# Altium project MCU089A.PrjPcb (part 2 of 4)

## Sheet MCU089A_F280025C_Device.SchDoc
size 431 x 279 mm; Date: Not shown in title block; ApprovedBy: Not shown in title block; CheckedBy: Not shown in title block; Author: Not shown in title block; CompanyName: Not shown in title block; Engineer: Not shown in title block; Organization: Not shown in title block; Address1: Not shown in title block; Address2: Not shown in title block; Address3: Not shown in title block; Address4: Not shown in title block; DocumentNumber: 4; Revision: Use project parameter SCH_Rev; SheetNumber: 4; SheetTotal: 8; PageSetup: Record=PageOptions|CenterHorizontal=True|CenterVertical=True|PrintScale=1.00|XCorrection=1.00|YCorrection=1.00|PrintKind=0|BorderSize=5000000|LeftOffset=0|BottomOffset=0|Orientation=2|PaperLength=1000|PaperWidth=1000|Scale=100|PaperSource=15|PrintQuality=600|MediaType=1|DitherType=10|PaperKind=Letter|PrintScaleMode=1; CurrentTime: Not shown in title block; CurrentDate: Not shown in title block; Time: Not shown in title block; DocumentFullPathAndName: Not shown in title block; DocumentName: Not shown in title block; ModifiedDate: Not shown in title block; ImagePath: Not shown in title block
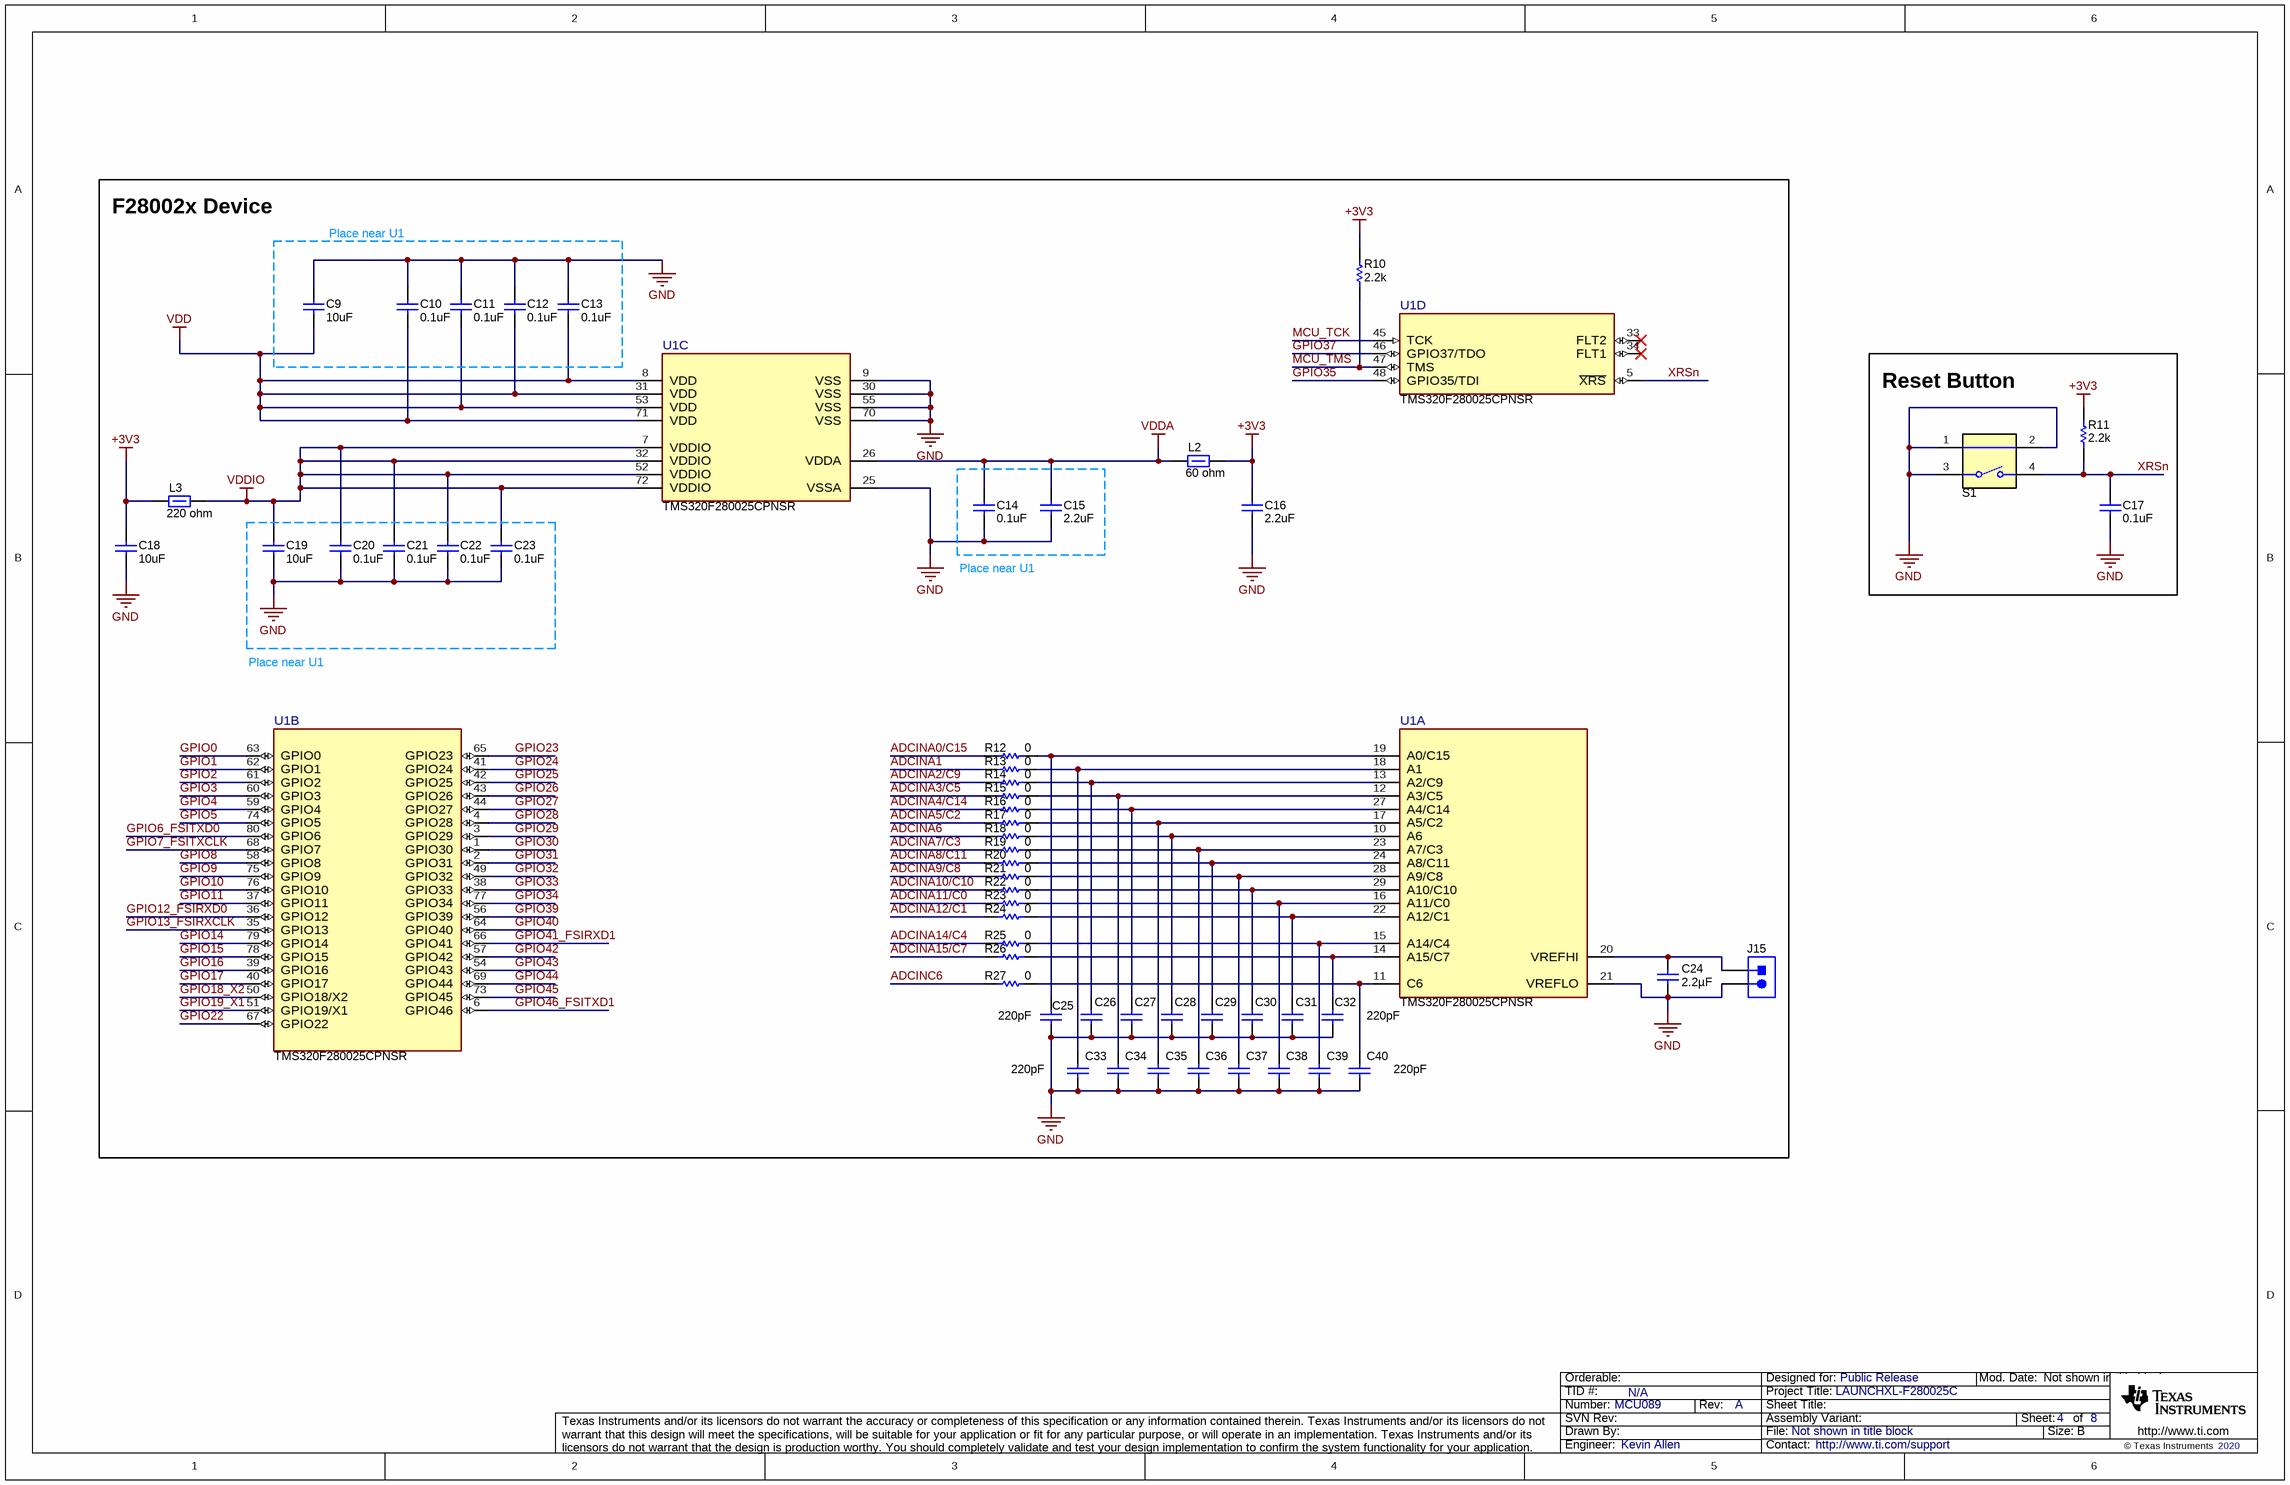
[diagram p3: MCU089A_F280025C_Device.SchDoc]

### Parts
C9  ValueDisplayed: 10uF  [0603]  (hidden comment: GRM188R61A106ME69D)
C10  ValueDisplayed: 0.1uF  [0402]  (hidden comment: GRM155R71A104KA01D)
C11  ValueDisplayed: 0.1uF  [0402]  (hidden comment: GRM155R71A104KA01D)
C12  ValueDisplayed: 0.1uF  [0402]  (hidden comment: GRM155R71A104KA01D)
C13  ValueDisplayed: 0.1uF  [0402]  (hidden comment: GRM155R71A104KA01D)
C14  ValueDisplayed: 0.1uF  [0402]  (hidden comment: GRM155R71A104KA01D)
C15  ValueDisplayed: 2.2uF  [0603]  (hidden comment: GRM188R61A225KE34D)
C16  ValueDisplayed: 2.2uF  [0603]  (hidden comment: GRM188R61A225KE34D)
C17  ValueDisplayed: 0.1uF  [0402]  (hidden comment: GRM155R71A104KA01D)
C18  ValueDisplayed: 10uF  [0603]  (hidden comment: GRM188R61A106ME69D)
C19  ValueDisplayed: 10uF  [0603]  (hidden comment: GRM188R61A106ME69D)
C20  ValueDisplayed: 0.1uF  [0402]  (hidden comment: GRM155R71A104KA01D)
C21  ValueDisplayed: 0.1uF  [0402]  (hidden comment: GRM155R71A104KA01D)
C22  ValueDisplayed: 0.1uF  [0402]  (hidden comment: GRM155R71A104KA01D)
C23  ValueDisplayed: 0.1uF  [0402]  (hidden comment: GRM155R71A104KA01D)
C24  Cap_F: 2.2µF  [0603]  (hidden comment: GRM188R61A225KE34D)
C25  Cap_F: 220pF  [0402]  (hidden comment: C1005C0G1H221F050BA)
C26  C1005C0G1H221F050BA  [0402]  (value not drawn)
C27  C1005C0G1H221F050BA  [0402]  (value not drawn)
C28  C1005C0G1H221F050BA  [0402]  (value not drawn)
C29  C1005C0G1H221F050BA  [0402]  (value not drawn)
C30  C1005C0G1H221F050BA  [0402]  (value not drawn)
C31  C1005C0G1H221F050BA  [0402]  (value not drawn)
C32  Cap_F: 220pF  [0402]  (hidden comment: C1005C0G1H221F050BA)
C33  Cap_F: 220pF  [0402]  (hidden comment: C1005C0G1H221F050BA)
C34  C1005C0G1H221F050BA  [0402]  (value not drawn)
C35  C1005C0G1H221F050BA  [0402]  (value not drawn)
C36  C1005C0G1H221F050BA  [0402]  (value not drawn)
C37  C1005C0G1H221F050BA  [0402]  (value not drawn)
C38  C1005C0G1H221F050BA  [0402]  (value not drawn)
C39  C1005C0G1H221F050BA  [0402]  (value not drawn)
C40  Cap_F: 220pF  [0402]  (hidden comment: C1005C0G1H221F050BA)
J15  61300211121  [WURTH_61300211121]  (value not drawn)
L2  value 60 ohm  [0805_HV]  (hidden comment: 742792063)
L3  ValueDisplayed: 220 ohm  [0805_HV]  (hidden comment: 742792022)
R10  ValueDisplayed: 2.2k  [0402]  (hidden comment: CRCW04022K20JNED)
R11  ValueDisplayed: 2.2k  [0402]  (hidden comment: CRCW04022K20JNED)
R12  ValueDisplayed: 0  [0402]  (hidden comment: ERJ-2GE0R00X)
R13  ValueDisplayed: 0  [0402]  (hidden comment: ERJ-2GE0R00X)
R14  ValueDisplayed: 0  [0402]  (hidden comment: ERJ-2GE0R00X)
R15  ValueDisplayed: 0  [0402]  (hidden comment: ERJ-2GE0R00X)
R16  ValueDisplayed: 0  [0402]  (hidden comment: ERJ-2GE0R00X)
R17  ValueDisplayed: 0  [0402]  (hidden comment: ERJ-2GE0R00X)
R18  ValueDisplayed: 0  [0402]  (hidden comment: ERJ-2GE0R00X)
R19  ValueDisplayed: 0  [0402]  (hidden comment: ERJ-2GE0R00X)
R20  ValueDisplayed: 0  [0402]  (hidden comment: ERJ-2GE0R00X)
R21  ValueDisplayed: 0  [0402]  (hidden comment: ERJ-2GE0R00X)
R22  ValueDisplayed: 0  [0402]  (hidden comment: ERJ-2GE0R00X)
R23  ValueDisplayed: 0  [0402]  (hidden comment: ERJ-2GE0R00X)
R24  ValueDisplayed: 0  [0402]  (hidden comment: ERJ-2GE0R00X)
R25  ValueDisplayed: 0  [0402]  (hidden comment: ERJ-2GE0R00X)
R26  ValueDisplayed: 0  [0402]  (hidden comment: ERJ-2GE0R00X)
R27  ValueDisplayed: 0  [0402]  (hidden comment: ERJ-2GE0R00X)
S1  1188E-1K2-V-TR  [SW_1188E]  (value not drawn)
U1  TMS320F280025CPNSR  [PN0080A-MFG]  (parts A,B,C,D of 4)

### Blocks framed on the sheet
F28002x Device: C9-C16 C18-C40 J15 L2 L3 R10 R12-R27 U1
Reset Button: C17 R11 S1

### Nets
+3V3: C16.1 C18.1 L2.2 L3.1 R10.2 R11.2
GND: C9.1 C10.2 C11.2 C12.2 C13.2 C14.1 C15.2 C16.2 C17.1 C18.2 C19.2 C20.1 C21.1 C22.1 C23.1 C24.2 C25.2 C26.2 C27.2 C28.2 C29.2 C30.2 C31.2 C32.2 C33.2 C34.2 C35.2 C36.2 C37.2 C38.2 C39.2 C40.2 J15.2 S1.1 S1.2 S1.3 U1.9(VSS) U1.21(VREFLO) U1.25(VSSA) U1.30(VSS) U1.55(VSS) U1.70(VSS)
VDD: C9.2 C10.1 C11.1 C12.1 C13.1 U1.8(VDD) U1.31(VDD) U1.53(VDD) U1.71(VDD)
VDDA: C14.2 C15.1 L2.1 U1.26(VDDA)
VDDIO: C19.1 C20.2 C21.2 C22.2 C23.2 L3.2 U1.7(VDDIO) U1.32(VDDIO) U1.52(VDDIO) U1.72(VDDIO)
ADCINA0/C15: R12.1
ADCINA1: R13.1
ADCINA2/C9: R14.1
ADCINA3/C5: R15.1
ADCINA4/C14: R16.1
ADCINA5/C2: R17.1
ADCINA6: R18.1
ADCINA7/C3: R19.1
ADCINA8/C11: R20.1
ADCINA9/C8: R21.1
ADCINA10/C10: R22.1
ADCINA11/C0: R23.1
ADCINA12/C1: R24.1
ADCINA14/C4: R25.1
ADCINA15/C7: R26.1
ADCINC6: R27.1
GPIO0: U1.63(GPIO0)
GPIO1: U1.62(GPIO1)
GPIO2: U1.61(GPIO2)
GPIO3: U1.60(GPIO3)
GPIO4: U1.59(GPIO4)
GPIO5: U1.74(GPIO5)
GPIO6_FSITXD0: U1.80(GPIO6)
GPIO7_FSITXCLK: U1.68(GPIO7)
GPIO8: U1.58(GPIO8)
GPIO9: U1.75(GPIO9)
GPIO10: U1.76(GPIO10)
GPIO11: U1.37(GPIO11)
GPIO12_FSIRXD0: U1.36(GPIO12)
GPIO13_FSIRXCLK: U1.35(GPIO13)
GPIO14: U1.79(GPIO14)
GPIO15: U1.78(GPIO15)
GPIO16: U1.39(GPIO16)
GPIO17: U1.40(GPIO17)
GPIO18_X2: U1.50(GPIO18/X2)
GPIO19_X1: U1.51(GPIO19/X1)
GPIO22: U1.67(GPIO22)
GPIO23: U1.65(GPIO23)
GPIO24: U1.41(GPIO24)
GPIO25: U1.42(GPIO25)
GPIO26: U1.43(GPIO26)
GPIO27: U1.44(GPIO27)
GPIO28: U1.4(GPIO28)
GPIO29: U1.3(GPIO29)
GPIO30: U1.1(GPIO30)
GPIO31: U1.2(GPIO31)
GPIO32: U1.49(GPIO32)
GPIO33: U1.38(GPIO33)
GPIO34: U1.77(GPIO34)
GPIO35: U1.48(GPIO35/TDI)
GPIO37: U1.46(GPIO37/TDO)
GPIO39: U1.56(GPIO39)
GPIO40: U1.64(GPIO40)
GPIO41_FSIRXD1: U1.66(GPIO41)
GPIO42: U1.57(GPIO42)
GPIO43: U1.54(GPIO43)
GPIO44: U1.69(GPIO44)
GPIO45: U1.73(GPIO45)
GPIO46_FSITXD1: U1.6(GPIO46)
MCU_TCK: U1.45(TCK)
MCU_TMS: R10.1 U1.47(TMS)
XRSn: C17.2 R11.1 S1.4 U1.5(~{XRS})
NetC24_1: C24.1 J15.1 U1.20(VREFHI)
NetC25_1: C25.1 R12.2 U1.19(A0/C15)
NetC26_1: C26.1 R14.2 U1.13(A2/C9)
NetC27_1: C27.1 R16.2 U1.27(A4/C14)
NetC28_1: C28.1 R18.2 U1.10(A6)
NetC29_1: C29.1 R20.2 U1.24(A8/C11)
NetC30_1: C30.1 R22.2 U1.29(A10/C10)
NetC31_1: C31.1 R24.2 U1.22(A12/C1)
NetC32_1: C32.1 R26.2 U1.14(A15/C7)
NetC33_1: C33.1 R13.2 U1.18(A1)
NetC34_1: C34.1 R15.2 U1.12(A3/C5)
NetC35_1: C35.1 R17.2 U1.17(A5/C2)
NetC36_1: C36.1 R19.2 U1.23(A7/C3)
NetC37_1: C37.1 R21.2 U1.28(A9/C8)
NetC38_1: C38.1 R23.2 U1.16(A11/C0)
NetC39_1: C39.1 R25.2 U1.15(A14/C4)
NetC40_1: C40.1 R27.2 U1.11(C6)

Not connected (* = marked no-connect by the designer): U1 33(FLT2)* 34(FLT1)*

### Notes on the sheet
- Place near U1
- Drawn By:
- SVN Rev:
- Number:
- TID #:
- Orderable:
- Rev:
- Sheet Title:
- File:
- Project Title:
- Designed for:
- Assembly Variant:
- Mod. Date:
- Sheet:
- Size:
- of
- B
- http://www.ti.com
- Texas Instruments and/or its licensors do not warrant the accuracy or completeness of this specification or any information contained therein. Texas Instruments and/or its licensors do not warrant that this design will meet the specifications, will be suitable for your application or fit for any particular purpose, or will operate in an implementation. Texas Instruments and/or its licensors do not warrant that the design is production worthy. You should completely validate and test your design implementation to confirm the system functionality for your application.
- Engineer:
- Contact:
- © Texas Instruments

### Library data of the parts
C9 C18 C19 = CMP-0007318-5: CAP, CERM, 10 uF, 10 V, +/- 20%, X5R, 0603; Manufacturer: MuRata; Polarized: N; Value: 10uF; U/M: EA; Cap_F: 10µF; Value1: Unknown; VDC_V: 10V; TaMin_C: -55°C; TaMax_C: 85°C; SizeArea_mm2: 1.28; SizeAreaWB_mm2: 4.68; SizeX_mm: 1.6; SizeY_mm: 0.8; SizeZ_mm: 1; AEC Category: Q200; CompType: Capacitor; PartNumber: GRM188R61A106ME69D; PackageReference: 0603; RoHS: Y; Tolerance_%: 20%; Value2: 10V; MountType: SMT; Technology: Ceramic; TempCo: X5R; Cap_Case: 0603; Published: 2008-06-19; Publisher: Texas Instruments; LatestRevisionDate: 2017-03-09; ComponentLink1Description: Datasheet link; ComponentLink1URL: http://psearch.murata.com/capacitor/product/GRM188R61A106ME69%23.pdf; AEC Qualified: ?
C10-C14 C17 C20-C23 = CMP-0006629-2: CAP, CERM, 0.1 uF, 10 V, +/- 10%, X7R, 0402; Manufacturer: MuRata; Polarized: N; Value: 0.1uF; U/M: EA; Cap_F: 100nF; Value1: Unknown; VDC_V: 10V; TaMin_C: -55°C; TaMax_C: 125°C; SizeArea_mm2: 0.5; SizeAreaWB_mm2: 3; SizeX_mm: 1; SizeZ_mm: 0.6; AEC Category: Q200; CompType: Capacitor; PartNumber: GRM155R71A104KA01D; PackageReference: 0402; RoHS: Y; Tolerance_%: 10%; Value2: 10V; MountType: SMT; Technology: Ceramic; TempCo: X7R; Cap_Case: 0402; SizeY_mm: 0.5; Published: 2008-06-19; Publisher: Texas Instruments; LatestRevisionDate: 2017-03-09; ComponentLink1Description: Datasheet link; ComponentLink1URL: http://search.murata.co.jp/Ceramy/PnsearchViewAction.do?HnOFG=ON&HnNFG=ON&SEL_CNT=50&sLang=en&sKey=GRM155R71A104KA01D&x=9&y=9&search=startwith; Supplier 1: Digi-Key; Supplier Part Number 1: GRM155R71A104KA01D-ND; Supplier 2: Newark; Supplier Part Number 2: 14T3278; Supplier 3: Mouser; Supplier Part Number 3: 81-GRM155R71A104KA1D; AEC Qualified: ?
C15 C16 = CMP-0007323-5: CAP, CERM, 2.2 uF, 10 V, +/- 10%, X5R, 0603; Manufacturer: MuRata; Polarized: N; Value: 2.2uF; U/M: EA; Cap_F: 2.2µF; Value1: Unknown; VDC_V: 10V; TaMin_C: -55°C; TaMax_C: 85°C; SizeArea_mm2: 1.28; SizeAreaWB_mm2: 4.68; SizeX_mm: 1.6; SizeY_mm: 0.8; SizeZ_mm: 1; AEC Category: Q200; CompType: Capacitor; PartNumber: GRM188R61A225KE34D; PackageReference: 0603; RoHS: Y; Tolerance_%: 10%; Value2: 10V; MountType: SMT; Technology: Ceramic; TempCo: X5R; Cap_Case: 0603; Published: 2008-06-19; Publisher: Texas Instruments; LatestRevisionDate: 2017-03-09; ComponentLink1Description: Datasheet link; ComponentLink1URL: http://search.murata.co.jp/Ceramy/PnsearchViewAction.do?HnOFG=ON&HnNFG=ON&SEL_CNT=50&sLang=en&sKey=GRM188R61A225KE34D&x=9&y=9&search=startwith; Supplier 1: Digi-Key; Supplier Part Number 1: 490-1545-1-ND; Supplier 2: Mouser; Supplier Part Number 2: 81-GRM188R61A225KE34; Supplier 3: Farnell; Supplier Part Number 3: 1828799; AEC Qualified: ?
C24 = CMP-0007323-5: CAP, CERM, 2.2 uF, 10 V, +/- 10%, X5R, 0603; Manufacturer: MuRata; Polarized: N; Value: 2.2uF; U/M: EA; Value1: Unknown; VDC_V: 10V; TaMin_C: -55°C; TaMax_C: 85°C; SizeArea_mm2: 1.28; SizeAreaWB_mm2: 4.68; SizeX_mm: 1.6; SizeY_mm: 0.8; SizeZ_mm: 1; AEC Category: Q200; CompType: Capacitor; PartNumber: GRM188R61A225KE34D; PackageReference: 0603; RoHS: Y; Tolerance_%: 10%; Value2: 10V; MountType: SMT; Technology: Ceramic; TempCo: X5R; Cap_Case: 0603; Published: 2008-06-19; Publisher: Texas Instruments; LatestRevisionDate: 2017-03-09; ComponentLink1Description: Datasheet link; ComponentLink1URL: http://search.murata.co.jp/Ceramy/PnsearchViewAction.do?HnOFG=ON&HnNFG=ON&SEL_CNT=50&sLang=en&sKey=GRM188R61A225KE34D&x=9&y=9&search=startwith; Supplier 1: Digi-Key; Supplier Part Number 1: 490-1545-1-ND; Supplier 2: Mouser; Supplier Part Number 2: 81-GRM188R61A225KE34; Supplier 3: Farnell; Supplier Part Number 3: 1828799; AEC Qualified: ?
C25-C40 = CMP-0006249-2: CAP, CERM, 220 pF, 50 V, +/- 1%, C0G/NP0, 0402; Manufacturer: TDK; TaMin_C: -55°C; Polarized: N; SizeAreaWB_mm2: 3; Value1: Unknown; U/M: EA; Value: 220pF; TaMax_C: 125°C; SizeZ_mm: 0.6; SizeX_mm: 1; SizeY_mm: 0.5; Value2: 50V; AEC Category: Q200; Supplier Part Number 2: 78Y9893; Publisher: Texas Instruments; Supplier 2: Newark; Supplier Part Number 3: 810-C1005C0G1H221F; TempCo: C0G/NP0; Supplier 3: Mouser; Published: 2008-06-19; RoHS: Y; MountType: SMT; Supplier 1: Digi-Key; PackageReference: 0402; Tolerance_%: 1%; Cap_Case: 0402; SizeArea_mm2: 0.5; CompType: Capacitor; LatestRevisionDate: 2017-03-09; PartNumber: C1005C0G1H221F050BA; AEC Qualified: N; VDC_V: 50V; ComponentLink1Description: Datasheet link; AEC Grade: N/A; Supplier Part Number 1: 445-7015-1-ND; Technology: Ceramic; ValueDisplayed: 220pF; ComponentLink1URL: http://www.tdk.com/pdf/tight_tol_B11.pdf
  C26-C31 C34-C39: Cap_F: 220pF
J15 = CMP-0054794-1: Header, 2.54 mm, 2x1, Gold, TH; Manufacturer: Wurth Elektronik; Green_Lifecycle: Active; Green_REACh: Passed; CNHeader: TRUE; CT: FALSE; PartNumber: 61300211121; PackageReference: Header, 2.54mm, 2x1, TH; ClassName: Header; CompType: Header; RoHS: Y; MountType: TH; ComponentLink1Description: Datasheet URL; ComponentLink1URL: http://katalog.we-online.de/em/datasheet/6130xx11121.pdf; Publisher: Texas Instruments; LatestRevisionDate: 26/05/2017; Supplier 1: Digi-Key; Supplier Part Number 1: 732-5315-ND; Supplier 2: Newark; Supplier Part Number 2: 20X0948; Supplier 3: Mouser; Supplier Part Number 3: 710-61300211121; Green_EU RoHS: Passed; Green_EU RoHS-2: Incomplete
L2 = CMP-0003093-1: Ferrite Bead, 60 ohm @ 100 MHz, 3 A, 0805; Manufacturer: Wurth Elektronik; Ztyp@1GHz_Ohm: 95.384; ZTyp@100MHz_Ohm: 60; SizeAreaWB_mm2: 6.75; DCR_ohm: 0.025; Value1: 0.025 ohm; Imax_A: 3A; SizeZ_mm: 1.45; SizeX_mm: 2; SizeY_mm: 1.25; SizeArea_mm2: 2.5; ComponentLink1URL: http://katalog.we-online.de/pbs/datasheet/742792063.pdf; Supplier Part Number 2: 710-742792063; Publisher: Texas Instruments; Supplier 2: Mouser; Published: 2014-04-30; RoHS: Y; MountType: SMT; Supplier 1: Digi-Key; PackageReference: 0805; Value2: 3A; CompType: Ferrite Bead; LatestRevisionDate: 2017-03-09; PartNumber: 742792063; ComponentLink1Description: Datasheet link; Supplier Part Number 1: 732-1612-1-ND; ValueDisplayed: 60 ohm
L3 = CMP-0003073-1: Ferrite Bead, 220 ohm @ 100 MHz, 2 A, 0805; Manufacturer: Wurth Elektronik; Ztyp@1GHz_Ohm: 190.289; ZTyp@100MHz_Ohm: 220; SizeAreaWB_mm2: 6.75; DCR_ohm: 0.05; Value1: 0.05 ohm; Value: 220 ohm; Imax_A: 2A; SizeZ_mm: 1.45; SizeX_mm: 2; SizeY_mm: 1.25; SizeArea_mm2: 2.5; ComponentLink1URL: http://katalog.we-online.de/pbs/datasheet/742792022.pdf; Supplier Part Number 2: 710-742792022; Publisher: Texas Instruments; Supplier 2: Mouser; Published: 2014-04-30; RoHS: Y; MountType: SMT; Supplier 1: Digi-Key; PackageReference: 0805; Value2: 2A; CompType: Ferrite Bead; LatestRevisionDate: 2017-03-09; PartNumber: 742792022; ComponentLink1Description: Datasheet link; Supplier Part Number 1: 732-1614-1-ND
R10 R11 = CMP-0026890-5: RES, 2.2 k, 5%, 0.063 W, AEC-Q200 Grade 0, 0402; Manufacturer: Vishay-Dale; Value: 2.2k; Value_Code: 2k20; Power_W: 63mW; Value2: 0.063W; VDC_V: 50V; TempCo: 200 ppm/C; SizeArea_mm2: 0.5; SizeX_mm: 1; SizeZ_mm: 0.6; EIA_Code: E24; AEC Category: Q200; AEC Qualified: Y; AEC Grade: 0; CompType: Resistor; PartNumber: CRCW04022K20JNED; PackageReference: 0402; RoHS: E; Res_ohm: 2.2k; Tolerance_%: 5%; Value1: 5%; MountType: SMT; Technology: Thick Film; SizeY_mm: 0.5; ComponentLink1Description: Datasheet link; ComponentLink1URL: http://www.vishay.com/docs/20035/dcrcwe3.pdf; Supplier 1: Digi-Key; Supplier Part Number 1: 541-2.2KJCT-ND; Supplier 2: Newark; Supplier Part Number 2: 59M6710; Supplier 3: Mouser; Supplier Part Number 3: 71-CRCW0402J-2.2K-E3
R12-R27 = CMP-0026992-3: RES, 0, 5%, 0.1 W, AEC-Q200 Grade 0, 0402; Manufacturer: Panasonic; Power_W: 100mW; TempCo: 600 ppm/C; Value_Code: 0000; Value: 0; EIA_Code: E24; SizeX_mm: 1; SizeY_mm: 0.5; SizeZ_mm: 0.6; Value2: 0.1W; AEC Qualified: Y; VDC_V: 50V; AEC Category: Q200; SizeAreaWB_mm2: 3; Supplier Part Number 2: 65T8307; Supplier 2: Newark; Supplier Part Number 3: 667-ERJ-2GE0R00X; Supplier 3: Mouser; RoHS: Y; Value1: 5%; MountType: SMT; Supplier 1: Digi-Key; PackageReference: 0402; Tolerance_%: 5%; Res_ohm: 0; SizeArea_mm2: 0.5; CompType: Resistor; PartNumber: ERJ-2GE0R00X; ComponentLink1Description: Datasheet link; Supplier Part Number 1: P0.0JCT-ND; Technology: Thick Film; ComponentLink1URL: https://industrial.panasonic.com/cdbs/www-data/pdf/RDA0000/AOA0000C301.pdf; AEC Grade: 0
S1 = CMP-0002328-1: Switch, SPST, 0.05 A, 12 VDC, SMD; Manufacturer: Diptronics; SizeAreaWB_mm2: 53.9; SizeArea_mm2: 27.3; SizeX_mm: 7.8; SizeY_mm: 3.5; VDC_V: 12V; PositionCount: 1; CurrentRating_mA: 50A; PartNumber: 1188E-1K2-V-TR; MountType: SMT; SizeZ_mm: 3.5; ComponentLink1Description: Datasheet URL; ComponentLink1URL: http://www.dip.com.tw/en/en-product-information/en-switch004/item/download/1976_b080c057386714e3a6604cbe658b9df3; RoHS: Y; Circuit: SPST; Orientation: Side Actuated; CompType: Switch; PackageReference: 7.8x3.5mm; Publisher: Texas Instruments; LatestRevisionDate: 2017-03-09
U1 = CMP-0089804-2: 32-bit MCU with 100 MHz, FPU, TMU, 128-KB flash, CLB 80-LQFP -40 to 125; Manufacturer: Texas Instruments; TJmax_C: +125°C; Number Of Spi Channels: 2; CompType: IC; Max Supply Voltage: 3.63V; Number Of Pwm Channels: 14; AEC Qualified: No; Memory Size: 128KBytes; Interface: I2C,SPI,UART,CAN,LIN,SCI,Other; Min Supply Voltage: 2.8V; SizeZ_mm: 1.6mm; Number Of Adc Channels: 16; Number Of Timers/Counters: 3; Ram Size: 24KBytes; Number Of Cores: 1; Frequency_Fixed: 100MHz; Number Of I/Os: 43; Data Bus Width: 32bits; Standoff Height: 0.05mm; Core Architecture: TMS320C28x; AEC Category: Q200; TaMin_C: -40°C; Number Of A/D Converters: 2; helpURL: https://upverter.com/upn/revision/e6f10be0003e77e0/; ComponentLink3Description: Online Datasheet; Memory Type: FLASH; ComponentLink3URL: http://www.ti.com/product/GPN/datasheet; ComponentLink1Description: Datasheet Link; ComponentLink2Description: Product Folder; Operating Temperature Range: -40°C to +125°C; Datasheet Path: datasheets/IC-TMS320F280025CPNSR.pdf; Number Of Uart Channels: 1; PartNumber: TMS320F280025CPNSR; RoHS: UNKNOWN; Number Of I2C Channels: 2; TaMax_C: +125°C; PackageReference: LQFP80; Part Number: TMS320F280025CPNSR; ComponentLink1URL: http://www.ti.com/lit/ds/symlink/GPN.pdf; ComponentLink2URL: http://www.ti.com/product/GPN; PartId: 1